# EAGLE design joystick_shield (EAGLE 9.6.0)
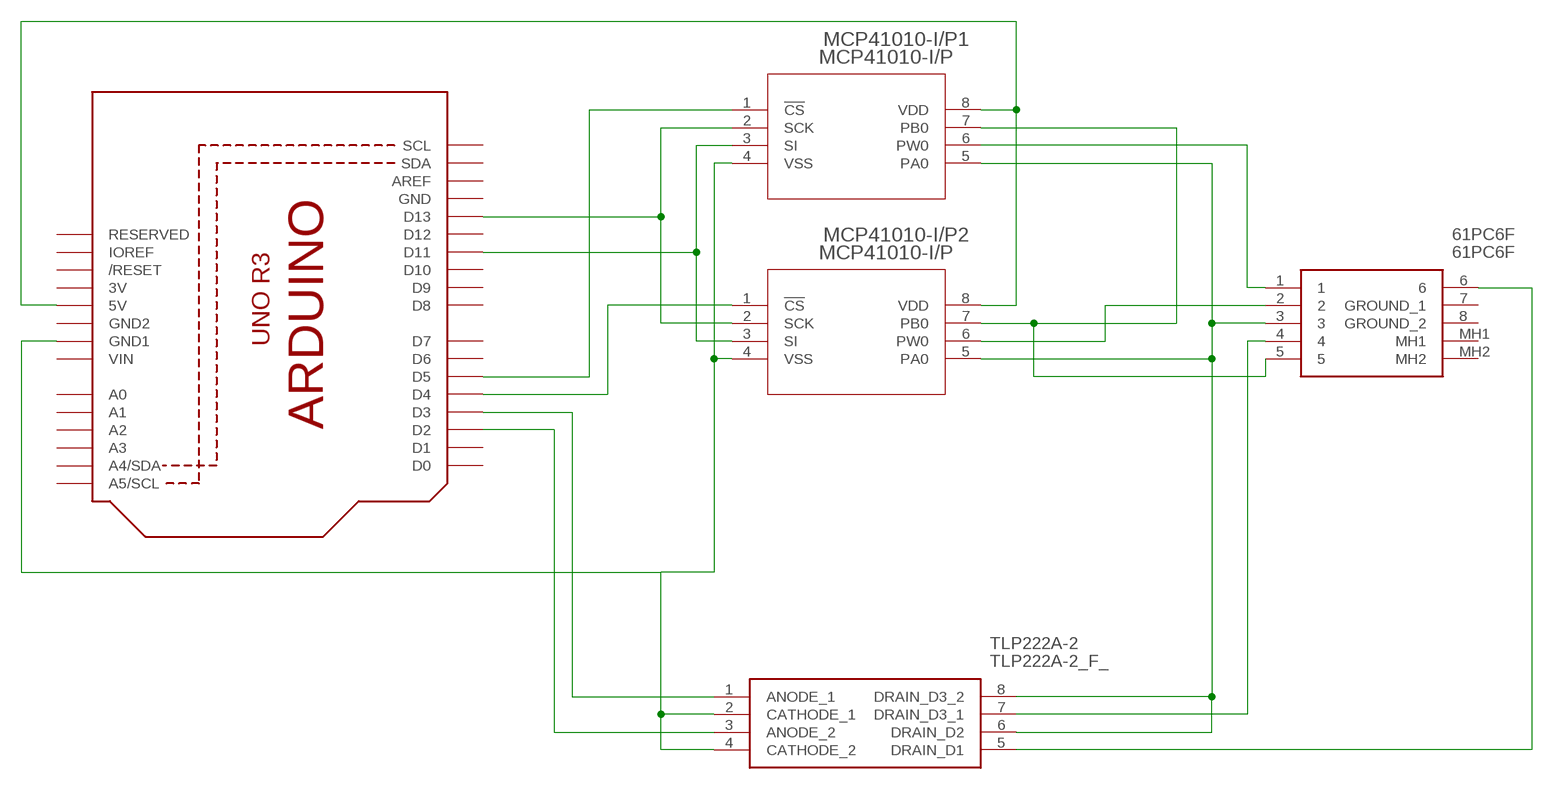
[diagram p0: schematic, sheet 1]

## Parts
61PC6F  61PC6F  [61PC6F]
MCP41010-I/P1  MCP41010-I/P  [PDIP8_300MC]
MCP41010-I/P2  MCP41010-I/P  [PDIP8_300MC]
TLP222A-2  TLP222A-2_F_  [DIP762W60P254L966H485Q8N]
U3  ARDUINOR3-BPLACE  [ARDUINOR3-BPLACE]

## Nets
N$1: MCP41010-I/P1.2(SCK) MCP41010-I/P2.2(SCK) U3.D13
N$2: MCP41010-I/P2.1(!CS) U3.D4
N$3: MCP41010-I/P1.3(SI) MCP41010-I/P2.3(SI) U3.D11
N$4: MCP41010-I/P1.4(VSS) MCP41010-I/P2.4(VSS) TLP222A-2.2(CATHODE_1) TLP222A-2.4(CATHODE_2) U3.GND1
N$5: MCP41010-I/P1.1(!CS) U3.D5
N$6: TLP222A-2.1(ANODE_1) U3.D3
N$7: MCP41010-I/P1.8(VDD) MCP41010-I/P2.8(VDD) U3.5V
N$8: TLP222A-2.3(ANODE_2) U3.D2
N$9: 61PC6F.3 MCP41010-I/P1.5(PA0) MCP41010-I/P2.5(PA0) TLP222A-2.6(DRAIN_D2) TLP222A-2.8(DRAIN_D3_2)
N$10: 61PC6F.4 TLP222A-2.7(DRAIN_D3_1)
N$11: 61PC6F.5 MCP41010-I/P1.7(PB0) MCP41010-I/P2.7(PB0)
N$12: 61PC6F.6 TLP222A-2.5(DRAIN_D1)
N$13: 61PC6F.2 MCP41010-I/P2.6(PW0)
N$17: 61PC6F.1 MCP41010-I/P1.6(PW0)
Unconnected: 61PC6F.7(GROUND_1) 61PC6F.8(GROUND_2) 61PC6F.MH1 61PC6F.MH2 U3.A0 U3.A1 U3.A2 U3.A3 U3.A4(A4/SDA) U3.A5(A5/SCL) U3.AREF U3.D0 U3.D1 U3.D6 U3.D7 U3.D8 U3.D9 U3.D10 U3.D12 U3.IOREF U3.RESERVED U3.RESET(/RESET) U3.SCL U3.SDA

## Power pins joined to a net without a drawn wire
3V: U3.3V
GND: U3.GND
GND2: U3.GND2
VIN: U3.VIN

## Library data of the parts
61PC6F = SamacSys_Parts:61PC6F: Conn Circular DIN F 6 POS Solder RA Thru-Hole 6 Terminal 1 Port Source: Datasheet <https://componentsearchengine.com/Datasheets/1/61PC6F.pdf>; DESCRIPTION: Conn Circular DIN F 6 POS Solder RA Thru-Hole 6 Terminal 1 Port; HEIGHT: 21mm; MANUFACTURER_NAME: Switchcraft; MANUFACTURER_PART_NUMBER: 61PC6F; MOUSER_PART_NUMBER: 502-61PC6F; MOUSER_PRICE-STOCK: https://www.mouser.com/Search/Refine.aspx?Keyword=502-61PC6F
MCP41010-I/P1 MCP41010-I/P2 = mcp41010:MCP41010-I/P; BUILT_BY: EMA_Jessica; COPYRIGHT: Copyright (C) 2018 Accelerated Designs. All rights reserved; MANUFACTURER_PART_NUMBER: MCP41010-I/P; VENDOR: Microchip
TLP222A-2 = SamacSys_Parts:TLP222A-2_F_: MOSFET Output Optocouplers Photorelay Voff=60V Ion=0.5/0.4A dual Source: Datasheet <https://componentsearchengine.com/Datasheets/1/TLP222A-2(F).pdf>; DESCRIPTION: MOSFET Output Optocouplers Photorelay Voff=60V Ion=0.5/0.4A dual; HEIGHT: 4.85mm; MANUFACTURER_NAME: Toshiba; MANUFACTURER_PART_NUMBER: TLP222A-2(F); MOUSER_PART_NUMBER: 757-TLP222A-2(F); MOUSER_PRICE-STOCK: https://www.mouser.com/Search/Refine.aspx?Keyword=757-TLP222A-2%28F%29
U3 = adafruit:ARDUINOR3: This is a new object for the new Arduino R3 - with extra pins that you may want to use (such as IOref, and duplicated A4/A5

## Board
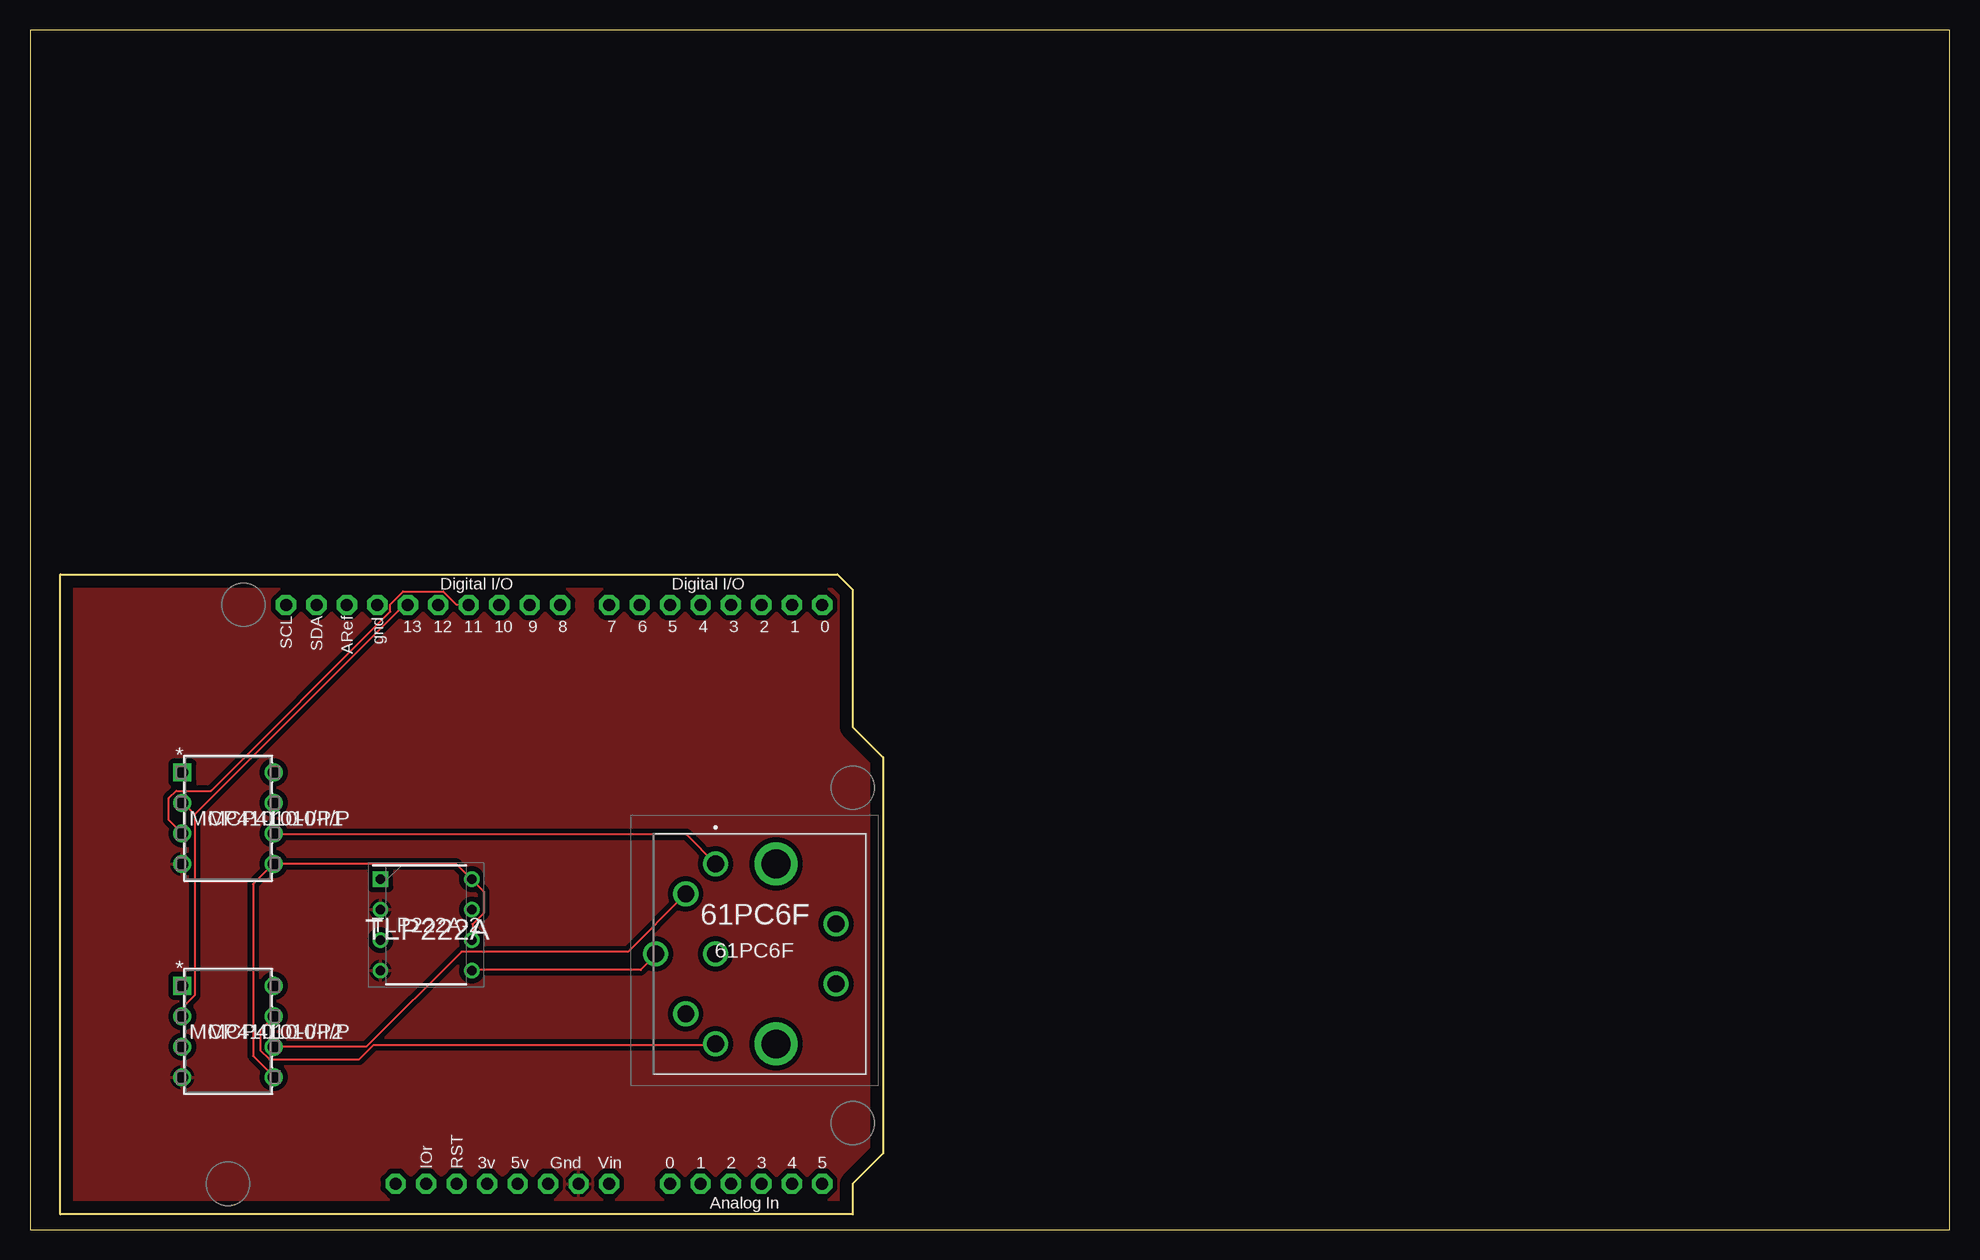
[diagram p1: board, top side]
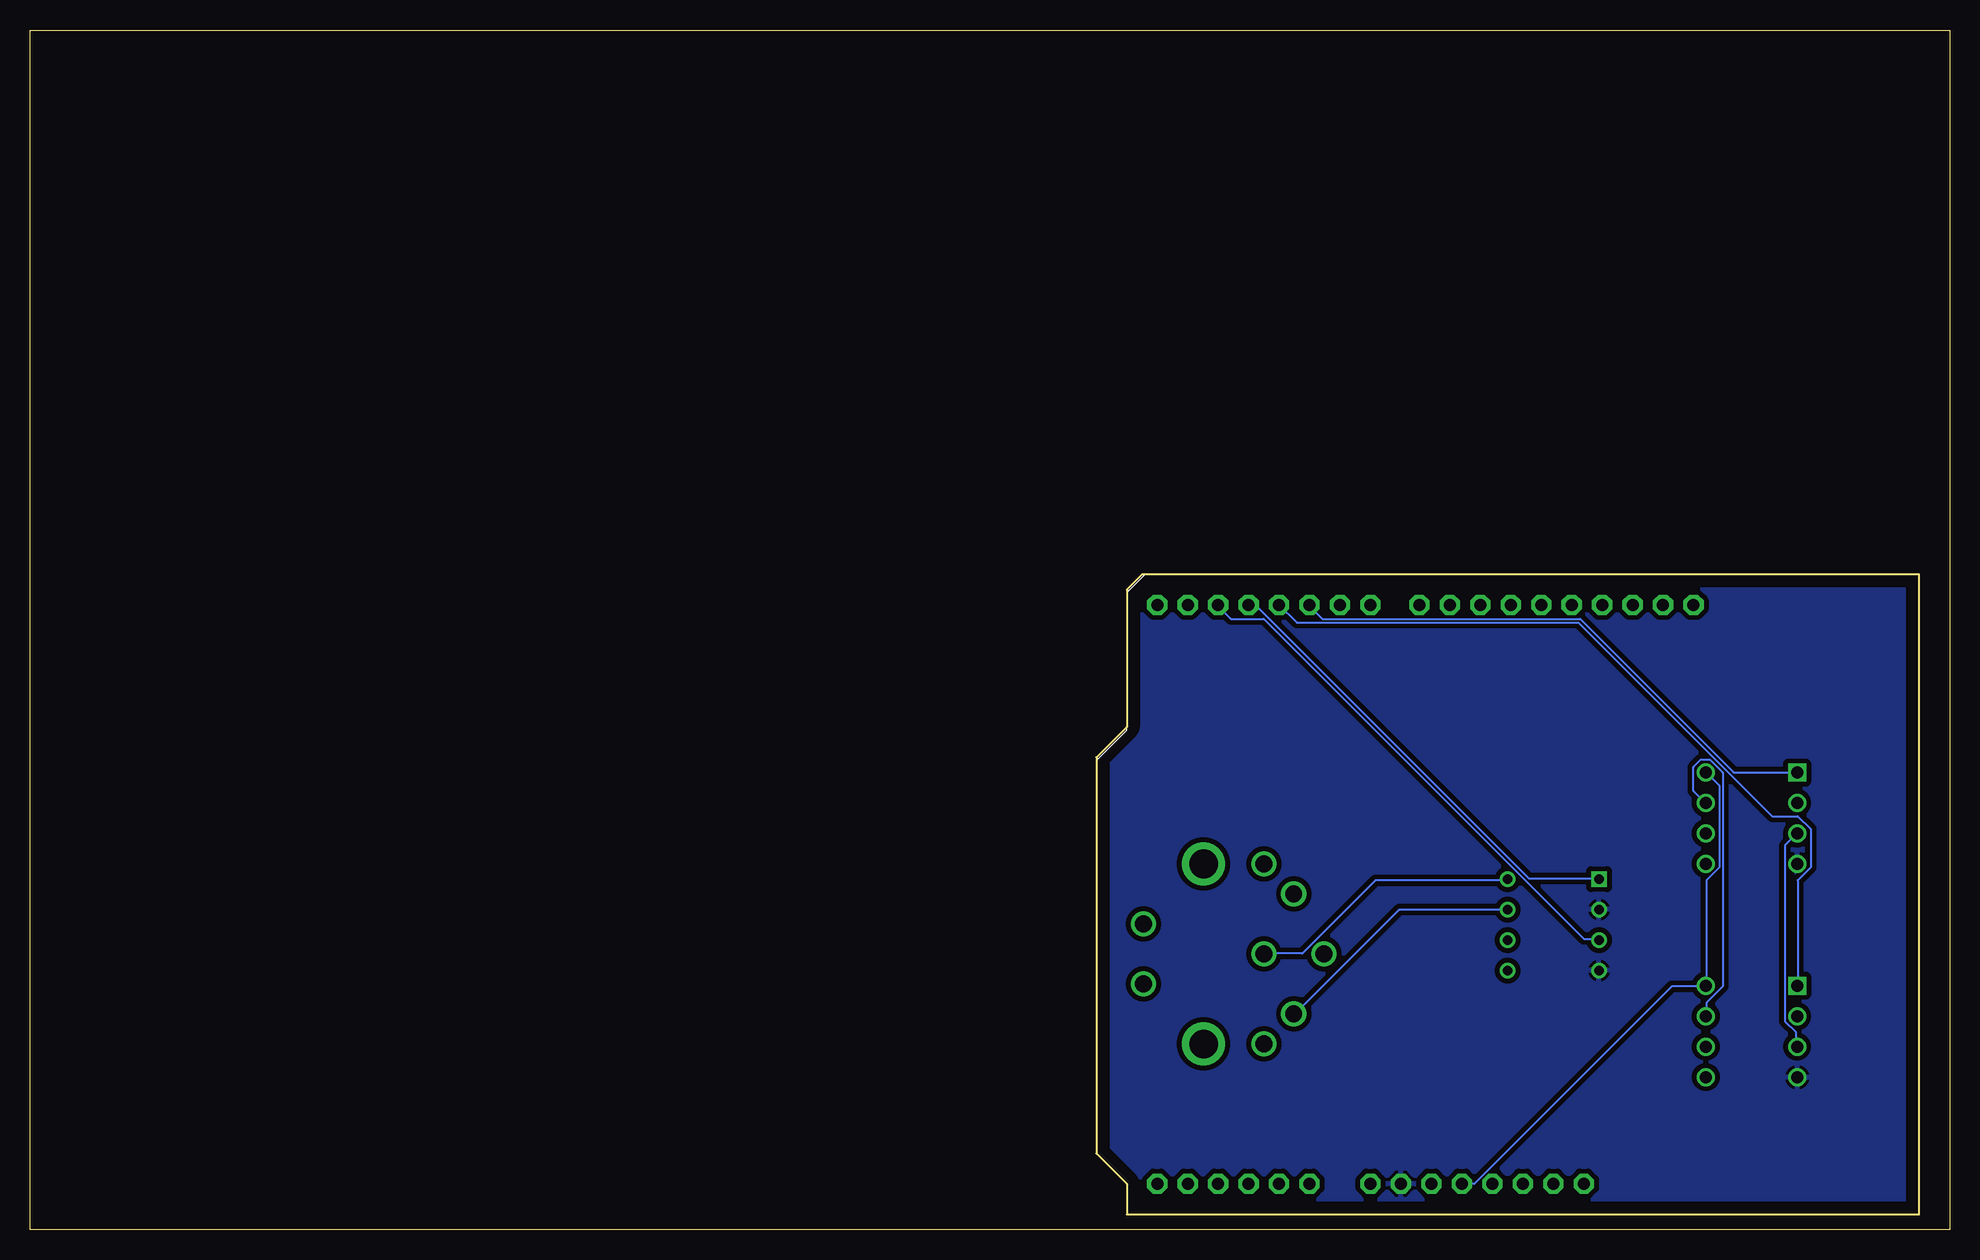
[diagram p2: board, bottom side, seen from below]

Size 160 x 100 mm. Coordinates in mm from the lower left corner, seen from the top.
Outline: 0,0 160,0 160,100 0,100 0,0
Outline: 2.54,54.61 67.31,54.61 68.58,53.34 68.58,41.91 71.12,39.37 71.12,6.35 68.58,3.81 68.58,1.27 2.54,1.27 2.54,54.61
Copper layers (1*16): Top 0.035mm / dielectric 1.5mm / Bottom 0.035mm
Design rules "default": minimum track width 6mil, minimum drill 0.35mm, track to track 6mil, track to pad 6mil, pad to pad 6mil, via to via 6mil, smd to smd 6mil, copper to edge 40mil, drill to drill 6mil, minimum pad ring 10mil, minimum via ring 8mil, stop-mask expansion 4mil, vias tented up to drill 0mil, thermal gap 10mil

### Footprints (pad centres in the part's own frame; a part is rotated, then mirrored left to right if it is on the bottom)
61PC6F = drill 1.4 pad 2.1: 1 0,0; 2 2.49,2.5; 3 0,7.505; 4 2.49,12.51; 5 0,15.01; 6 5,7.505; 7 -10.03,5.005; 8 -10.03,10.005 | drill 2.39 pad 3.585: MH1 -5.03,15.01; MH2 -5.03,0
PDIP8_300MC = drill 0.991 pad 1.499 square: 1 -7.62,7.62 | drill 0.991 pad 1.499: 2 -7.62,5.08; 3 -7.62,2.54; 4 -7.62,0; 5 0,0; 6 0,2.54; 7 0,5.08; 8 0,7.62
DIP762W60P254L966H485Q8N = drill 0.8 pad 1.2 square: 1 -3.81,3.81 | drill 0.8 pad 1.2: 2 -3.81,1.27; 3 -3.81,-1.27; 4 -3.81,-3.81; 5 3.81,-3.81; 6 3.81,-1.27; 7 3.81,1.27; 8 3.81,3.81
ARDUINOR3-BPLACE = drill 1 pad 1.676 octagon: 3V 35.56,2.54; 5V 38.1,2.54; A0 50.8,2.54; A1 53.34,2.54; A2 55.88,2.54; A3 58.42,2.54; A4 60.96,2.54; A5 63.5,2.54; AREF 23.876,50.8; D0 63.5,50.8; D1 60.96,50.8; D2 58.42,50.8; D3 55.88,50.8; D4 53.34,50.8; D5 50.8,50.8; D6 48.26,50.8; D7 45.72,50.8; D8 41.656,50.8; D9 39.116,50.8; D10 36.576,50.8; D11 34.036,50.8; D12 31.496,50.8; D13 28.956,50.8; GND 26.416,50.8; GND1 43.18,2.54; GND2 40.64,2.54; IOREF 30.48,2.54; RESERVED 27.94,2.54; RESET 33.02,2.54; SCL 18.796,50.8; SDA 21.336,50.8; VIN 45.72,2.54

### Placement (x,y rotation side)
61PC6F  57.15,30.48 180 top
MCP41010-I/P1  20.32,30.48 0 top
MCP41010-I/P2  20.32,12.7 0 top
TLP222A-2  33.02,25.4 0 top
U3  2.54,1.27 0 top

### Tracks (layer width: path | path; a pad name or v marks a point on that pad's centre or on a via)
N$1
  Top 0.152: 13.72,34.59 13.72,19.51 12.8,18.59 12.8,17.83 MCP41010-I/P2.2 | 13.72,34.59 12.8,35.51 MCP41010-I/P1.2 | 13.72,34.59 31.09,51.97 31.39,51.97 U3.D13
N$2
  Bottom 0.152: U3.D4 54.41,50.6 30.94,50.6 14.78,34.44 12.65,34.44 11.58,33.38 11.58,30.18 12.65,29.11 12.65,20.42 MCP41010-I/P2.1
N$3
  Top 0.152: MCP41010-I/P1.3 11.58,34.14 11.58,35.97 12.19,36.58 15.09,36.58 30.02,51.51 30.02,52.12 31.09,53.19 34.44,53.19 35.51,52.12 36.58,52.12 U3.D11
  Bottom 0.152: MCP41010-I/P1.3 13.72,32 13.72,17.37 12.8,16.46 12.8,15.24 MCP41010-I/P2.3
N$4
  Top 0.152: TLP222A-2.2 29.26,26.67 29.28,26.74
  pour Top (isolate 0.406): 2.54,54.61 67.31,54.61 68.58,53.34 68.58,41.91 71.12,39.37 71.12,6.35 68.58,3.81 68.58,1.27 2.54,1.27
  pour Bottom (isolate 0.406): 2.54,54.61 67.31,54.61 68.58,53.34 68.58,41.91 71.12,39.37 71.12,6.35 68.58,3.81 68.58,1.27 2.54,1.27
N$5
  Bottom 0.152: MCP41010-I/P1.1 17.98,38.1 30.79,50.9 52.27,50.9 53.34,51.97 U3.D5
N$6
  Bottom 0.152: TLP222A-2.1 29.26,29.26 35.05,29.26 57.76,51.97 58.37,51.97 U3.D3
N$7
  Bottom 0.152: MCP41010-I/P1.8 20.27,38.1 19.2,37.03 19.2,30.18 20.27,29.11 20.27,20.42 MCP41010-I/P2.8 20.42,20.27 23.16,20.27 39.62,3.81 U3.5V
N$8
  Bottom 0.152: TLP222A-2.3 29.26,24.23 30.48,24.23 57.15,50.9 59.89,50.9 60.96,51.97 U3.D2
N$9
  Top 0.152: MCP41010-I/P2.5 20.27,12.8 18.59,14.48 18.59,28.8 20.27,30.48 MCP41010-I/P1.5 35.51,30.48 36.73,29.26 TLP222A-2.8 36.88,29.11 37.8,28.19 37.8,26.36 36.88,25.45 36.88,24.23 TLP222A-2.6
  Bottom 0.152: 61PC6F.3 57.15,23.01 53.95,23.01 47.85,29.11 36.88,29.11 TLP222A-2.8
N$10
  Bottom 0.152: TLP222A-2.7 45.87,26.67 54.56,17.98 61PC6F.4
N$11
  Top 0.152: 61PC6F.5 57.15,15.39 28.65,15.39 27.43,14.17 19.96,14.17 19.2,14.94 19.2,16.61 20.27,17.68 MCP41010-I/P2.7
  Bottom 0.152: MCP41010-I/P1.7 21.34,36.58 21.34,38.56 20.73,39.17 19.96,39.17 18.9,38.1 18.9,20.27 20.27,18.9 20.27,17.83 MCP41010-I/P2.7
N$12
  Top 0.152: TLP222A-2.5 36.88,21.64 50.9,21.64 52.12,22.86 61PC6F.6
N$13
  Top 0.152: MCP41010-I/P2.6 28.04,15.24 35.97,23.16 49.84,23.16 54.56,27.89 61PC6F.2
N$17
  Top 0.152: 61PC6F.1 54.71,32.92 20.42,32.92 MCP41010-I/P1.6

### Text on the board
tPlace: 61PC6F | TLP222A